# EAGLE design Datalogger Shield RTC (EAGLE 9.5.2)
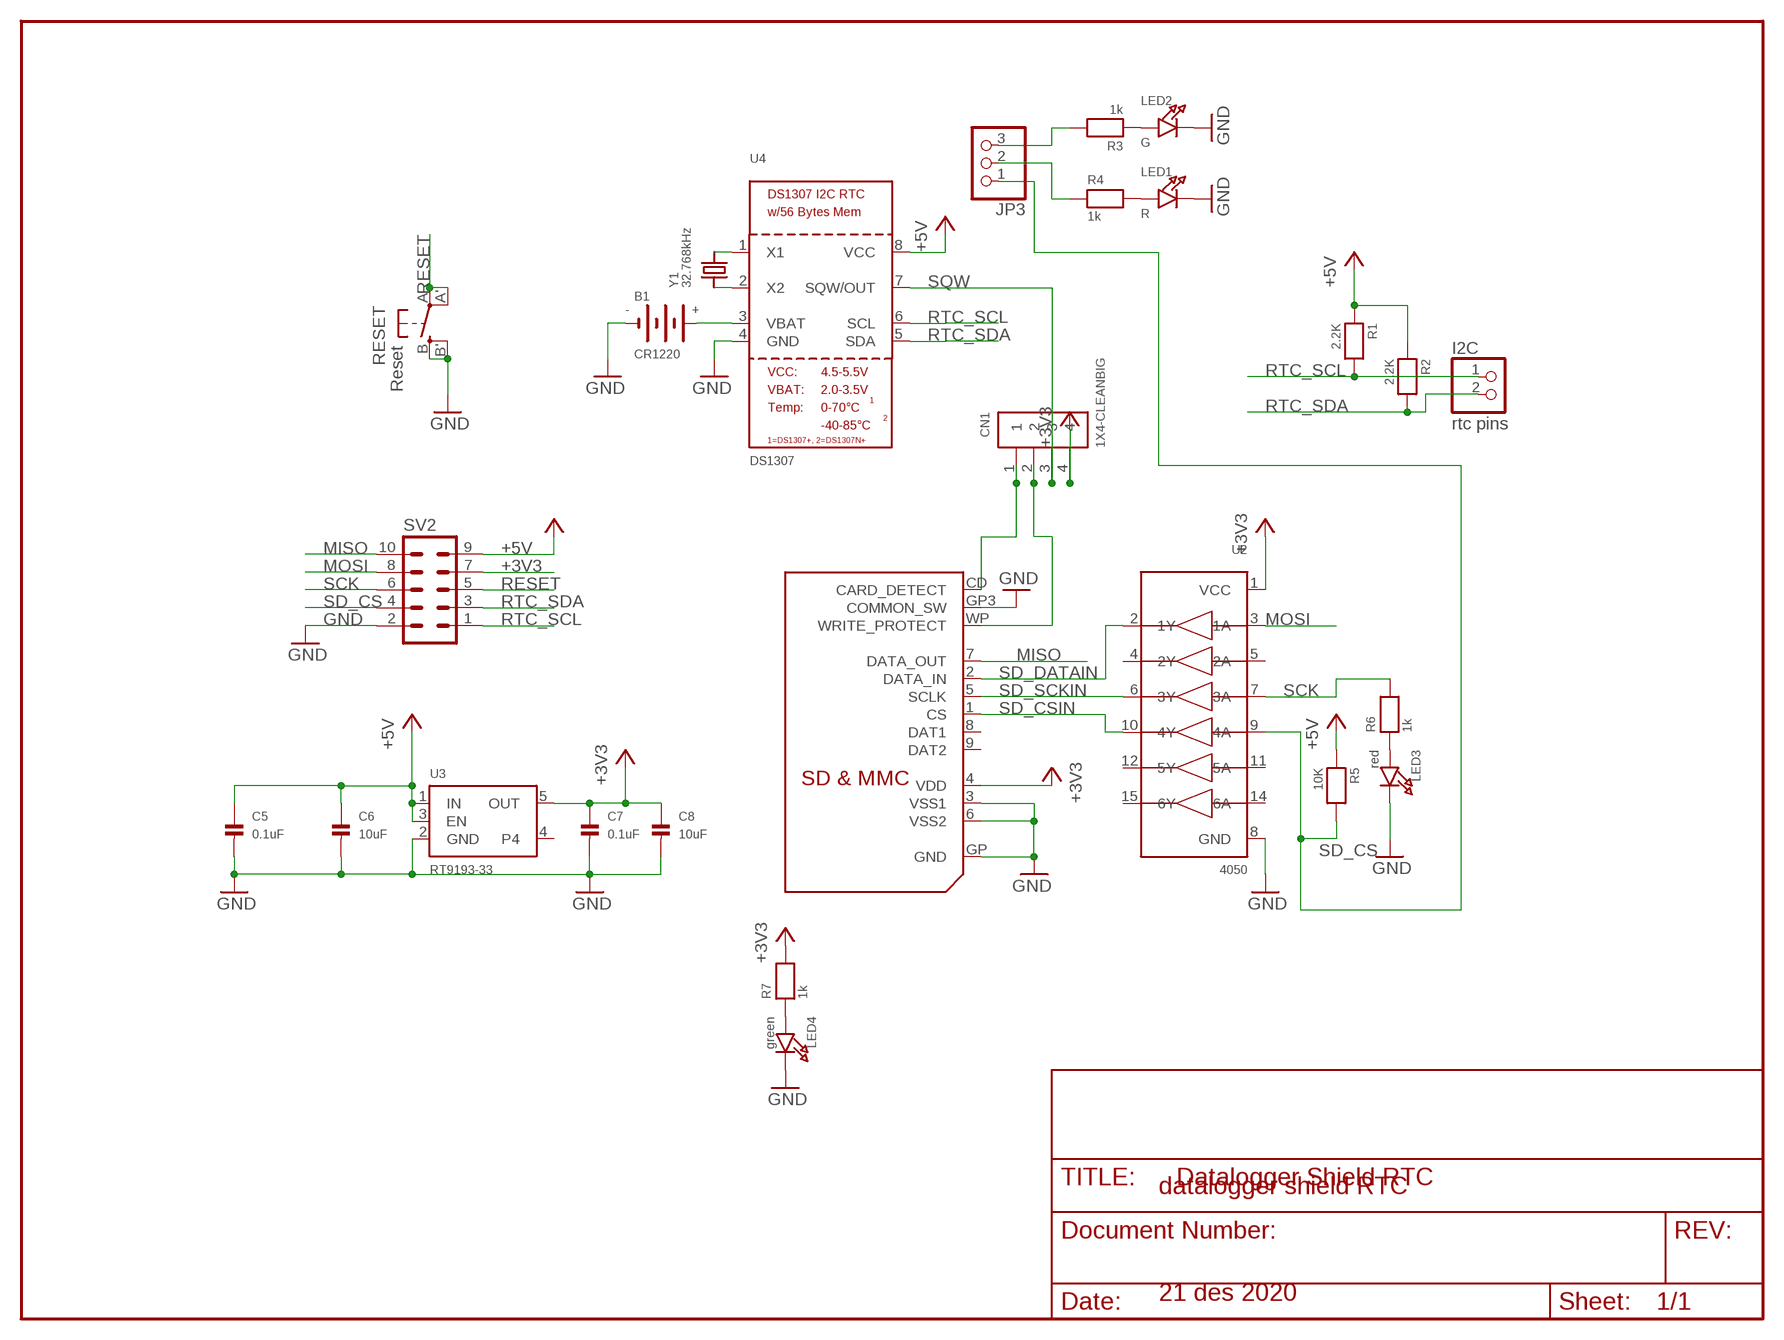
[diagram p0: schematic, sheet 1]

## Parts
B1  CR1220  BATTERYCR1220_SMT  [CR1220]
C5  0.1uF  CAP_CERAMIC0805  [0805]
C6  10uF  CAP_CERAMIC0805  [0805]
C7  0.1uF  CAP_CERAMIC0805  [0805]
C8  10uF  CAP_CERAMIC0805  [0805]
CN1  1X4-CLEANBIG  [1X04-CLEANBIG]
I2C  rtc pins  PINHD-1X2  [1X02]
JP3  HEADER-1X3ROUND  [1X03_ROUND]
LED1  R  LED0805  [CHIPLED_0805]
LED2  G  LED0805  [CHIPLED_0805]
LED3  red  LED0805  [CHIPLED_0805]
LED4  green  LED0805  [CHIPLED_0805]
R1  2.2K  RESISTOR0805  [0805]
R2  2.2K  RESISTOR0805  [0805]
R3  1k  RESISTOR0805  [0805]
R4  1k  RESISTOR0805  [0805]
R5  10K  RESISTOR0805  [0805]
R6  1k  RESISTOR0805  [0805]
R7  1k  RESISTOR0805  [0805]
RESET  Reset  SPST_TACT-EVQQ2  [EVQ-Q2]
SV2  MA05-2  [MA05-2]
U2  4050  74HC4050D  [SOIC16]
U3  RT9193-33  VREG_SOT23-5  [SOT23-5]
U4  DS1307  RTC_DS1307  [SOIC8_150MIL]
U$2  SDMMC06132  [06132]
Y1  32.768kHz  CRYSTAL8X3.8SMT  [CRYSTAL_8X3.8]

## Nets
+3V3: C7.1 C8.1 CN1.4 R7.2 SV2.7 U2.1(VCC) U3.5(OUT) U$2.4(VDD)
+5V: C5.1 C6.1 R1.1 R2.1 R5.1 SV2.9 U3.1(IN) U3.3(EN) U4.8(VCC)
GND: B1.- C5.2 C6.2 C7.2 C8.2 LED1.C LED2.C LED3.C LED4.C RESET.B'(S1) RESET.B(S) SV2.2 U2.8(GND) U3.2(GND) U4.4(GND) U$2.3(VSS1) U$2.6(VSS2) U$2.GP3(COMMON_SW) U$2.GP(GND)
MISO: SV2.10 U$2.7(DATA_OUT)
MOSI: SV2.8 U2.3(1A)
N$1: LED1.A R4.2
N$2: U4.2(X2) Y1.P$1
N$3: U4.1(X1) Y1.P$4
N$4: LED2.A R3.1
N$5: LED3.A R6.1
N$14: B1.+$1(+) U4.3(VBAT)
N$17: JP3.3 R3.2
N$20: JP3.2 R4.1
N$150: LED4.A R7.1
RESET: RESET.A'(P1) RESET.A(P) SV2.5
RTC_SCL: I2C.1 R1.2 SV2.1 U4.6(SCL)
RTC_SDA: I2C.2 R2.2 SV2.3 U4.5(SDA)
SCK: R6.2 SV2.6 U2.7(3A)
SD_CD: CN1.1 U$2.CD(CARD_DETECT)
SD_CS: JP3.1 R5.2 SV2.4 U2.9(4A)
SD_CSIN: U2.10(4Y) U$2.1(CS)
SD_DATAIN: U2.2(1Y) U$2.2(DATA_IN)
SD_SCKIN: U2.6(3Y) U$2.5(SCLK)
SD_WP: CN1.2 U$2.WP(WRITE_PROTECT)
SQW: CN1.3 U4.7(SQW/OUT)
Unconnected: U2.4(2Y) U2.5(2A) U2.11(5A) U2.12(5Y) U2.14(6A) U2.15(6Y) U3.4 U$2.8(DAT1) U$2.9(DAT2)

## Notes on the sheet
- datalogger shield RTC
- 21 des 2020

## Library data of the parts
B1 = microbuilder:BATTERY
C5-C8 = microbuilder:CAP_CERAMIC: Ceramic Capacitors 0402 - 0402 Surface Mount Capacitors 16pF 50V 5% [Digikey: 445-4899-2-ND] 18pF 50V 5% [Digikey: 490-1281-2-ND] 22pF 50V 5% [Digikey: 490-1283-2-ND] 68pF 50V 5% [Digikey: 490-1289-2-ND] 0.1uF 10V 10% [Digikey: 490-1318-2-ND] 1.0uF 6.3V 10% [Digikey: 490-1320-2-ND] 0603 - 0603 Surface Mount Capacitors 16 pF 50V 5% [Digikey: 445-5051-2-ND] 22 pF 50V [Digikey: PCC220ACVTR-ND] 33 pF 50V 5% [Digikey: 490-1415-1-ND] 56pF 50V 5% [Digikey: 490-1421-1-ND] 220pF 50V 5% [Digikey: 445-1285-1-ND] 680 pF 50V 2200 pF 50V 5% C0G [Digikey: 445-1297-1-ND] 5600 pF 100V 5% X7R [Digikey: 478-3711-1-ND] 0.1 µF 25V 10% [Digikey: PCC2277TR-ND] 0.22 µF 16V 10% X7R [Digikey: 445-1318-1-ND] 1.0 µF 25V 10% [Digikey: 445-5146-2-ND] 0603 - RF Specific 3pF 250V +/-0.1pF RF [Digikey: 712-1347-1-ND] 18 pF 250V 5% [Digikey: 478-3505-1-ND or 712-1322-1-ND] 56 pF 250V 5% C0G RF [Digikey: 490-4867-1-ND] 68 pF 250V RF [Digikey: 490-4868-1-ND] 0805 - 0805 Surface Mount Capacitors 220 pF 250V 2% RF Ceramic Capacitor [Digikey: 712-1398-1-ND] 1000 pF 50V 2% NP0 Ceramic Capacitor [Digikey: 478-3760-1-ND] 0.1 µF 25V 10% Ceramic Capacitor [Digikey: PCC1828TR-ND] 1.0 µF 16V 10% Ceramic Capacitor[Digikey: 490-1691-2-ND] 10.0 µF 10V 10% Ceramic Capacitor[Digikey: 709-1228-1-ND] 10.0 uF 16V 10% Ceramic Capacitor [Digikey: 478-5165-2-ND] 47 uF 6.3V 20% Ceramic Capacitor [Digikey: 587-1779-1-ND or 399-5506-1-ND] 1206 - 1206 Surface Mount Capacitors 47uF 10V 20% Ceramic Capacitor [Digikey: 490-5528-1-ND or 399-5508-1-ND or 445-6010-1-ND] 100uF 6.3V -20%, +80% Y5V Ceramic Capacitor (Digikey: 490-4512-1-ND, Mouser: 81-GRM31CF50J107ZE1L)
CN1 = adafruit:1X4: 4-pin connector
I2C = pinhead:PINHD-1X2: PIN HEADER
JP3 = microbuilder:HEADER-1X3: PIN HEADER
LED1-LED4 = microbuilder:LED: LED 0603 - 0603 Surface Mount Package 2mA: Green LED - Low Power (3.9mcd, 2ma, 1.7Vf) - Digikey: 475-2709-2-ND Orange LED - Low Power (9.8mcd, 2ma, 1.8Vf) - Digikey: 475-1194-2-ND Red LED - Low Power (5mcd, 2ma, 1.8Vf) - Digikey: 475-1195-2-ND Yellow LED - Low Power (7mcd, 2ma, 1.8Vf) - Digikey: 475-1196-2-ND 5mA: Blue LED - Low Power (17mcd, 5ma, 2.9Vf) - Digikey: LNJ937W8CRACT-ND 0805 - 0805 Surface Mount Package 2mA: Red LED (8.8mcd, 2mA, 1.8Vf, Clear) - Low Power [Digikey: 475-2510-1-ND] Green LED (5mcd, 2mA, 1.8Vf, Clear) - Low Power [Digikey: 475-2730-1-ND] Yellow LED (11.3mcd, 2mA, 1.8Vf, Clear) - Low Power [Digikey: 475-2555-1-ND] 20mA: Red LED (104mcd, 20mA, Diffused) - LS R976 [Digikey: 475-1278-6-ND] Red LED (12mcd, 20mA, 2.0Vf, Clear) - APT2012EC [Digikey: 754-1128-1-ND] Green LED (15mcd, 20mA, 2.2Vf, Clear) - APT2012GC [Digikey: 754-1131-1-ND] Orange LED (160mcd, 20mA, 2.1Vf, Clear) - APT2012SECK [Digikey: 754-1130-1-ND] 1206 - 1206 Surface Mount Package Green LED (26mcd, 20mA, Diffused) - LG N971 [Digikey: 475-1407-6-ND] Red LED (15mcd, 20mA, Diffused) - LH N974 [Digikey: 475-1416-6-ND]
R1-R7 = microbuilder:RESISTOR: Resistors 0402 - 0402 Surface Mount Package 22 Ohm 1% 1/16W [Digikey: 311-22.0LRTR-ND] 33 Ohm 5% 1/16W 1.0K 5% 1/16W 1.5K 5% 1/16W 2.0K 1% 1/16W 10.0K 1% 1/16W [Digikey: 311-10.0KLRTR-ND] 10.0K 5% 1/16W [Digikey: RMCF0402JT10K0TR-ND] 12.1K 1% 1/16W [Digikey: 311-22.0LRTR-ND] 100.0K 5% 1/16W 0603 - 0603 Surface Mount Package 0 Ohm 1/10 Watt 1% Resistor 15 Ohm 1/10 Watt 1% Resistor 33 Ohm 1/10 Watt 1% Resistor 49.9 Ohm 1/10 Watt 1% Resistor 100 Ohm 1/10 Watt 1% Resistor 150 Ohm 1/10 Watt 1% Resistor 240 Ohm 1/10 Watt 1% Resistor 390 Ohm 1/10 Watt 1% Resistor 560 Ohm 1/10 Watt 1% Resistor 680 Ohm 1/10 Watt 1% Resistor 750 Ohm 1/10 Watt 1% Resistor 1.0K Ohm 1/10 Watt 1% Resistor 1.5K Ohm 1/10 Watt 1% Resistor 2.0K Ohm 1/10 Watt 1% Resistor 2.2K Ohm 1/10 Watt 1% Resistor 3.3K Ohm 1/10 Watt 1% Resistor 4.7K Ohm 1/10 Watt 1% Resistor 10.0K Ohm 1/10 Watt 1% Resistor 12.0K Ohm 1/10 Watt 1% Resistor 12.1K Ohm 1/10 Watt 1% Resistor 20.0K Ohm 1/10 Watt 1% Resistor 33.0K Ohm 1/10 Watt 1% Resistor 100.0K Ohm 1/10 Watt 1% Resistor 0805 - 0805 Surface Mount Package 0 Ohm 1/8 Watt 1% Resistor 33 Ohm 1/8 Watt 1% Resistor 100 Ohm 1/8 Watt 1% Resistor 150 Ohm 1/8 Watt 1% Resistor 200 Ohm 1/8 Watt 1% Resistor 240 Ohm 1/8 Watt 1% Resistor 330 Ohm 1/8 Watt 1% Resistor 390 Ohm 1/8 Watt 1% Resistor 470 Ohm 1/8 Watt 1% Resistor 1.0K Ohm 1/8 Watt 1% Resistor 1.5K Ohm 1/8 Watt 1% Resistor 2.0K Ohm 1/8 Watt 1% Resistor 4.7K Ohm 1/8 Watt 1% Resistor 5.1K Ohm 1/8 Watt 1% Resistor 5.6K Ohm 1/8 Watt 1% Resistor 10.0K Ohm 1/8 Watt 1% Resistor 22.0K Ohm 1/8 Watt 1% Resistor 33.0K Ohm 1/8 Watt 1% Resistor 100K Ohm 1/8 Watt 1% Resistor 1206 - 1206 Surface Mount Package 2012 - 2010 Surface Mount Package 0.11 Ohm 1/2 Watt 1% Resistor - Digikey: RHM.11UCT-ND
RESET = adafruit:SPST_TACT: SMT 6mm switch, EVQQ2 series http://www.ladyada.net/library/eagle
SV2 = con-lstb:MA05-2: PIN HEADER; OC_FARNELL: unknown; OC_NEWARK: unknown
U2 = microbuilder:74HC4050D: 6-channel level shifter 74HC4050D - 2V-6V Supply Digikey: 74HC4050D,653-ND Mouser: 771-74HC4050D-T
U3 = microbuilder:VREG_SOT23-5: SOT23-5 Fixed Voltage Regulators To better organise some of the SOT23-5 fixed voltage regulators in this library, this new part was created. Part Current Out V Out V In V Dropout Digikey Part No. ADP121 150mA 3.3V 3.4-5.5V 0.09V @ 150mA ADP121-AUJZ33R7CT-ND ADP121 150mA 3.0V 3.1-5.5V 0.09V @ 150mA ADP121-AUJZ30R7CT-ND ADP122 300mA 3.3V 3.4-5.5V 0.085V @ 300mA ADP122AUJZ-3.3-R7CT-ND ADP1712 300mA 3.3V 3.5-5.5V 0.17V @ 300mA ADP1712AUJZ-3.3-R7TR-ND AP7311 (Low Cost) 150mA 3.3V 3.5-6V 0.15V @ 150mA AP7311-33WG-7DICT-ND LD39015M18R 150mA 1.8V 1.9V-5.5V 0.08V @ 100mA 497-6977-1-ND MCP1824T-3302E/OT 300mA 3.3V 3.5V-6V 0.2V @ 300mA MCP1824T-3302E/OTCT-ND MIC5205-2.5YM5 TR 150mA 2.5V 2.7-16V 0.165V @ 150mA 576-1257-2-ND MIC5205-3.0YM5 TR 150mA 3.0V 3.2V-16V 0.165V @ 150mA 576-1258-2-ND MIC5205-3.3YM5 TR 150mA 3.3V 3.5V-16V 0.165V @ 150mA 576-1259-2-ND TPS780330220 150mA 3.3V+2.2V 3.6-5.5V 250mV Max 296-23332-1-ND TDA3663/N1,135 100mA 3.3V 3.5-45V 0.18V @ 50mA 568-5343-1-ND
U4 = microbuilder:RTC_DS1307: DS1307 I2C RTC with 56-Bytes RAM; SPICEPREFIX: X
U$2 = adafruit:SDMMC: SD MMC Card holder 4UCON part #06132 - easy to solder
Y1 = microbuilder:CRYSTAL: Crystals HC49UP - Surface Mount Crystal 4.0MHz 18pF +/-30ppm Surface Mount Crystal [Digikey: 535-9857-1-ND] 12.0 MHz Surface Mount Crystal [Digikey: 535-9869-6-ND] 25.0 MHz Surface Mount Crystal [Digikey: 535-9078-1-ND] 3.2 x 2.5mm - MEMs SMT Crystal 12.0 MHz 8pF 15ppm 3.2 x 2.5mm Crystal [Digikey: -10-70°C: 644-1047-1-ND -40-125°C: 644-1128-1-ND] 16.0 MHz 8pF 15ppm 3.2 x 2.5mm Crystal [Digikey: -10-70°C: 644-1049-1-ND -40-125°C: 644-1129-2-ND] 16.0 MHz 10pF 10ppm 3.2 x 2.5mm Crystal [Digikey: 644-1100-1-ND] 27.12 MHz 18pF 30ppm 3.2 x 2.5mm Crystal [Digikey: 887-1424-1-ND] 27.12MHz 10pF 10ppm 3.2 x 2.5mm Crystal [Digikey: 887-1329-1-ND] 4.9 x 1.8mm - MEMs SMT Crystal 32.768 KHz 12.5pF 20ppm 4.9 x 1.8mm Crystal [Digikey: SE2415CT-ND] 8.0 x 3.8mm - Surface Mount Crystal 32.768kHz 12.5pF 20ppm -40°C-85°C [Digikey: 535-9166-2-ND] Cylinder 32.768KHz Cylinder Crystal (2x6mm body) [Ex. Digikey: 300-8341-2-ND]

## Board
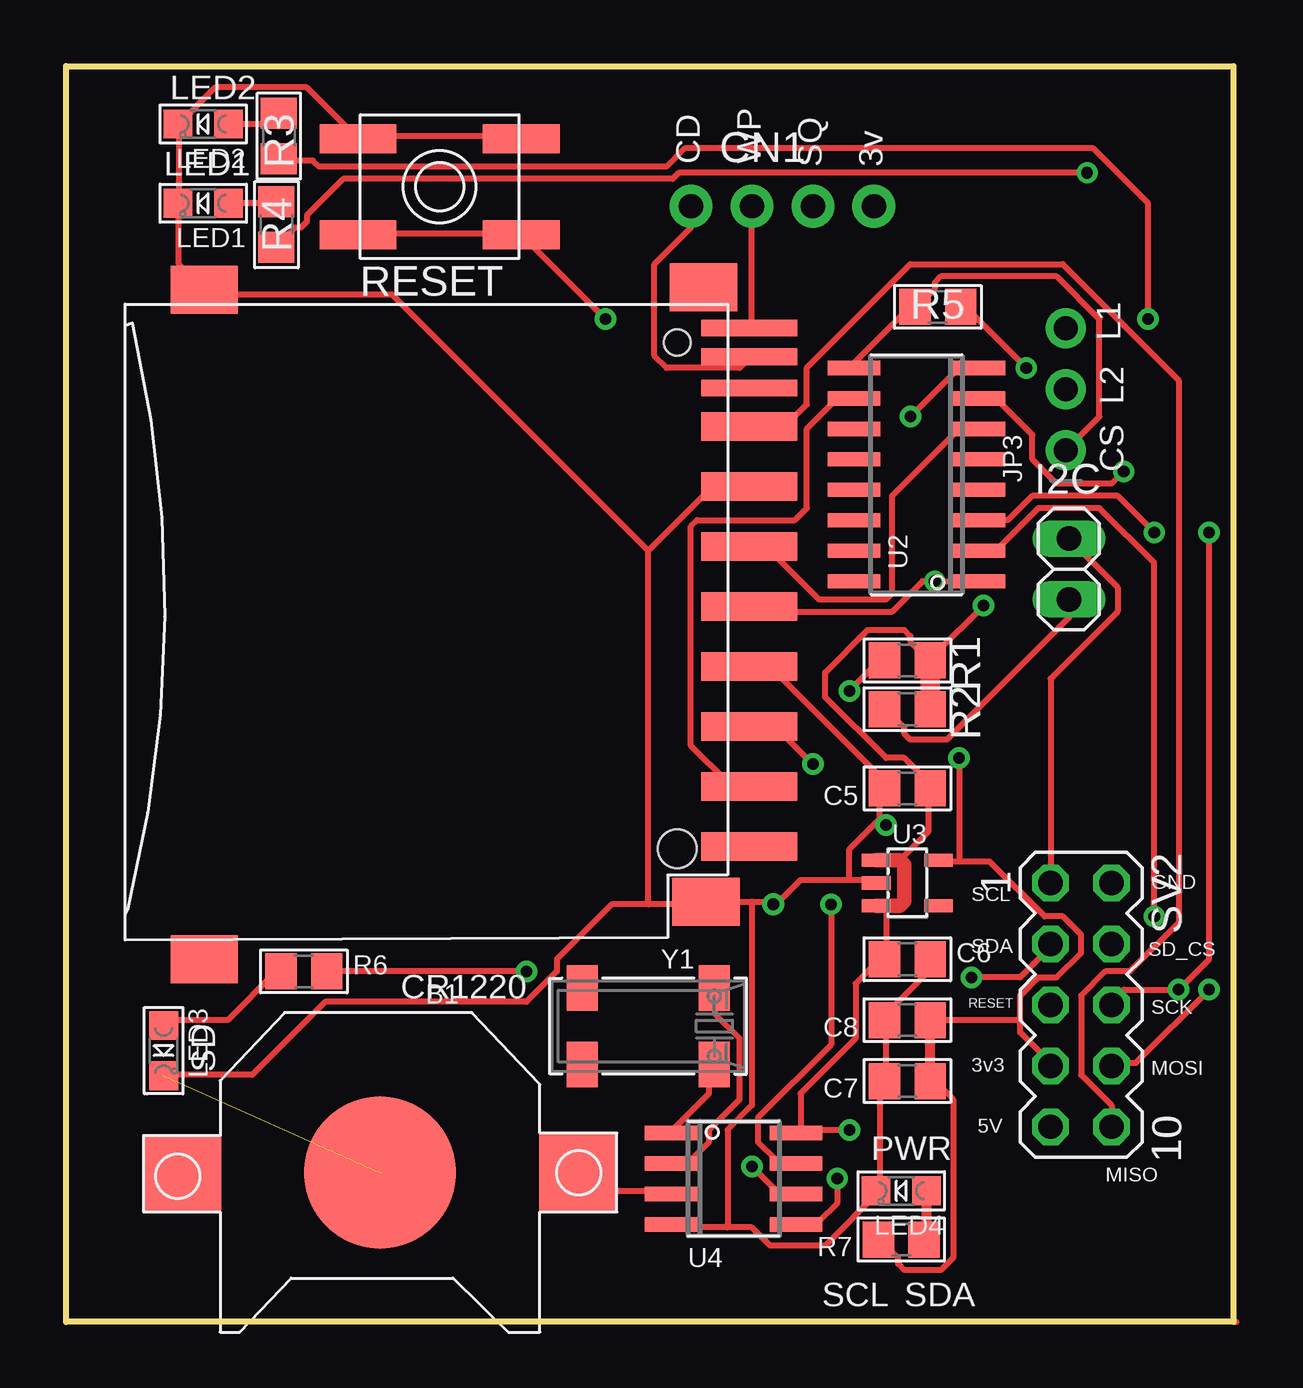
[diagram p1: board, top side]
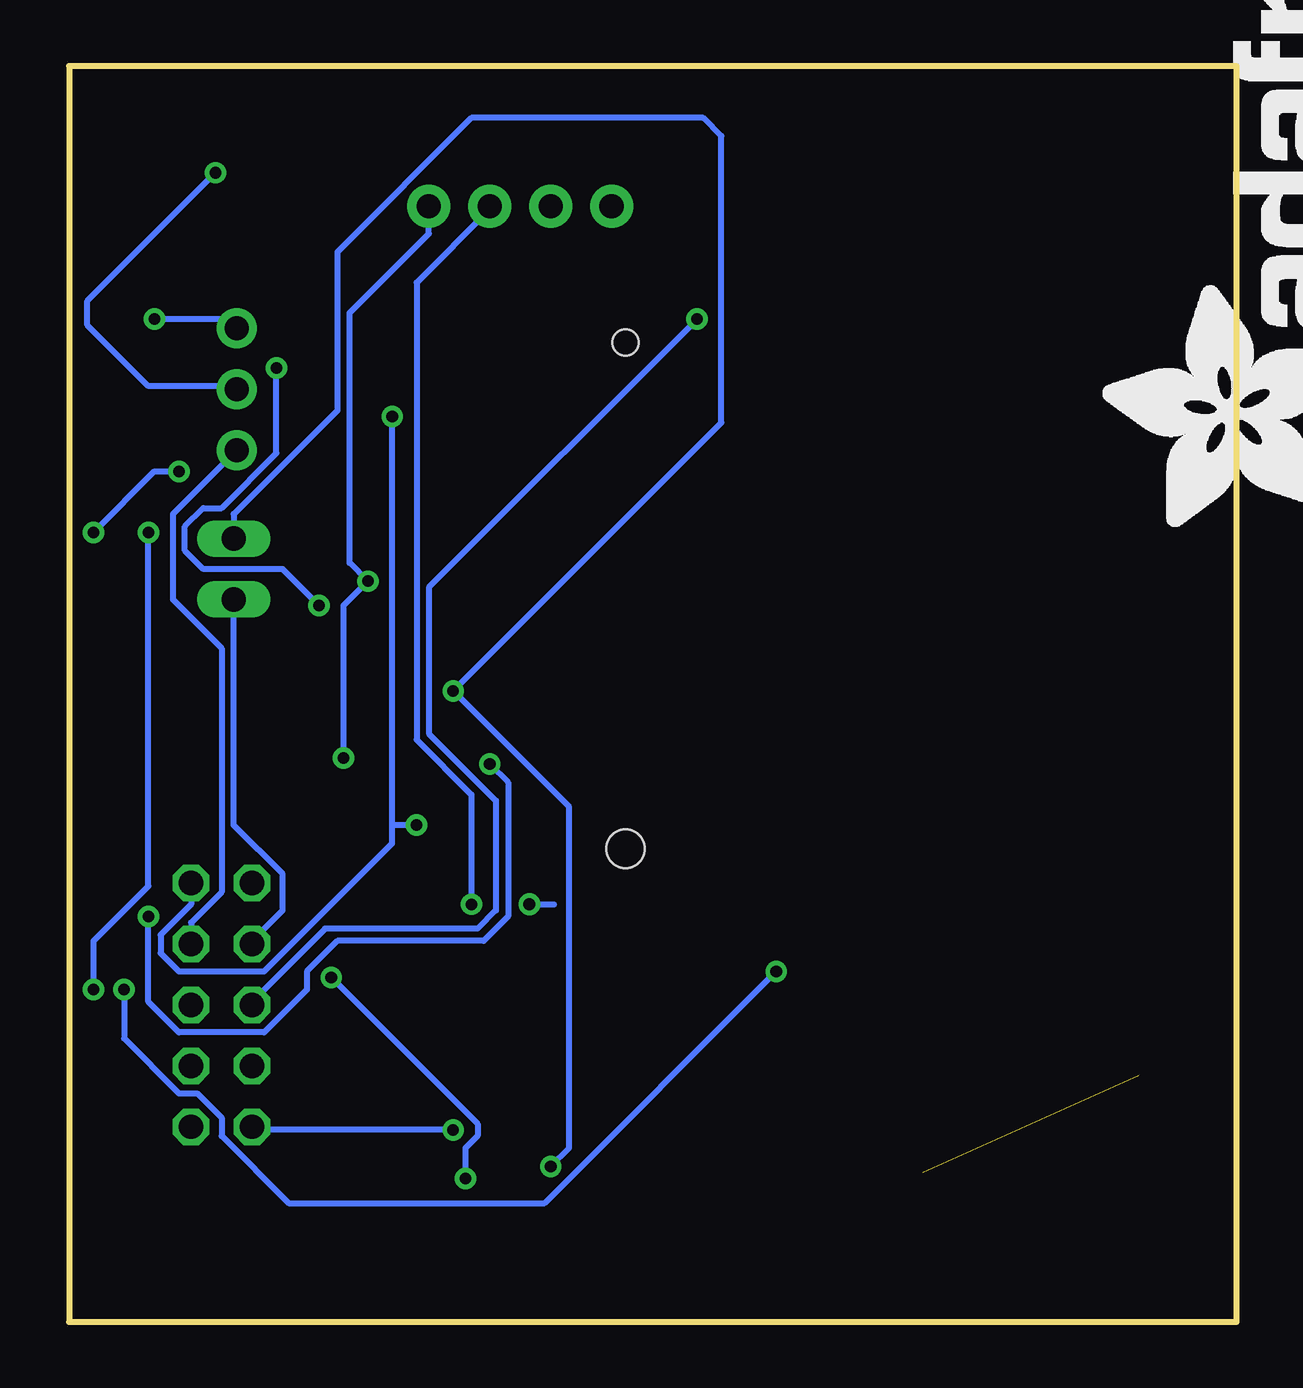
[diagram p2: board, bottom side, seen from below]

Size 48.64 x 52.32 mm. Coordinates in mm from the lower left corner, seen from the top.
Outline: 0,52.32 48.64,52.32 48.64,0 0,0 0,52.32
Copper layers (1*16): Top 0.035mm / dielectric 1.5mm / Bottom 0.035mm
Design rules "default": minimum track width 10mil, minimum drill 19mil, track to track 10mil, track to pad 10mil, pad to pad 10mil, via to via 10mil, smd to smd 8mil, copper to edge 10mil, drill to drill 8mil, minimum pad ring 10mil, minimum via ring 8mil, stop-mask expansion 4mil, vias tented up to drill 20mil, thermal gap 10mil

### Footprints (pad centres in the part's own frame; a part is rotated, then mirrored left to right if it is on the bottom)
CR1220 = smd 3.2 x 3.2: +$1 -8.225,0; +$2 8.225,0 | smd 6.35 x 6.35: - 0,0
0805 = smd 1.3 x 1.5: 1 -0.95,0; 2 0.95,0
1X04-CLEANBIG = drill 1.016 pad 1.778: 1 -3.81,0; 2 -1.27,0; 3 1.27,0; 4 3.81,0
1X02 = drill 1.016 long: 1 -1.27,0; 2 1.27,0
1X03_ROUND = drill 1 pad 1.676: 1 -2.54,0; 2 0,0; 3 2.54,0
CHIPLED_0805 = smd 1.2 x 1.2: A 0,-1.05; C 0,1.05
EVQ-Q2 = smd 3.2 x 1.2: A -3.4,-2; A' 3.4,-2; B -3.4,2; B' 3.4,2
MA05-2 = drill 1.016 octagon: 1 -5.08,-1.27; 2 -5.08,1.27; 3 -2.54,-1.27; 4 -2.54,1.27; 5 0,-1.27; 6 0,1.27; 7 2.54,-1.27; 8 2.54,1.27; 9 5.08,-1.27; 10 5.08,1.27
SOIC16 = smd 0.6 x 2.2: 1 -4.445,-2.6; 2 -3.175,-2.6; 3 -1.905,-2.6; 4 -0.635,-2.6; 5 0.635,-2.6; 6 1.905,-2.6; 7 3.175,-2.6; 8 4.445,-2.6; 9 4.445,2.6; 10 3.175,2.6; 11 1.905,2.6; 12 0.635,2.6; 13 -0.635,2.6; 14 -1.905,2.6; 15 -3.175,2.6; 16 -4.445,2.6
SOT23-5 = smd 0.55 x 1.2: 1 -0.95,-1.3; 2 0,-1.3; 3 0.95,-1.3; 4 0.95,1.3; 5 -0.95,1.3
SOIC8_150MIL = smd 0.6 x 2.2: 1 -1.905,-2.6; 2 -0.635,-2.6; 3 0.635,-2.6; 4 1.905,-2.6; 5 1.905,2.6; 6 0.635,2.6; 7 -0.635,2.6; 8 -1.905,2.6
06132 = smd 1.2 x 4: 1 6.9,0.9; 2 4.4,0.9; 3 1.9,0.9; 4 -0.6,0.9; 5 -3.1,0.9; 6 -5.6,0.9; 7 -8.1,0.9; 9 9.4,0.9 | smd 0.7 x 4: 8 -9.7,0.9; CD -11,0.9; WP -12.2,0.9 | smd 2 x 2.8: GP -13.8,-21.8; GP2 14.1,-21.8; GP3 11.7,-0.9; GP4 -13.9,-1 | hole 1.1: -11.6,-2.1 | hole 1.6: 9.5,-2.1
CRYSTAL_8X3.8 = smd 1.3 x 1.9: P$1 -2.75,-1.6; P$2 2.75,-1.6; P$3 2.75,1.6; P$4 -2.75,1.6

### Placement (x,y rotation side)
B1  13.08,6.22 180 top
C5  35.05,22.23 180 top
C6  35.05,15.11 0 top
C7  35.05,10.03 180 top
C8  35.05,12.57 180 top
CN1  29.84,46.48 0 top
I2C  41.78,31.37 270 top
JP3  41.66,38.86 90 top
LED1  5.72,46.61 90 top
LED2  5.72,49.91 90 top
LED3  4.06,11.3 180 top
LED4  34.8,5.46 90 top
R1  35.05,27.56 180 top
R2  35.05,25.53 180 top
R3  8.87,49.41 270 top
R4  8.76,45.72 90 top
R5  36.32,42.29 180 top
R6  9.91,14.61 0 top
R7  34.8,3.43 180 top
RESET  15.56,47.3 0 top
SV2  42.29,13.21 270 top
U2  35.43,35.31 90 top
U3  35.05,18.29 270 top
U4  27.81,5.97 270 top
U$1  [ADAFRUIT_TEXT_30MM]  -5.97,32.89 90 bottom  (outside the outline)
U$2  27.56,29.21 270 top
Y1  24.26,12.32 180 top

### Tracks (layer width: path | path; a pad name or v marks a point on that pad's centre or on a via)
+3V3  (via drill 0.48)
  Top 0.254: R7.2 33.91,3.43 34.67,2.67 34.67,2.41 34.93,2.16 36.45,2.16 36.96,2.67 36.96,9.27 36.2,10.03 C7.1 | 37.21,19.18 38.48,19.18 40.77,16.89 41.53,16.89 42.29,16.13 42.29,15.37 41.27,14.35 40.51,14.35 39.75,13.59 39.75,12.57 | 37.21,19.18 36.45,19.18 U3.5 | 39.75,12.57 39.75,12.07 41.02,10.8 SV2.7 | 39.75,12.57 C8.1 | U2.1 v36.2,30.86 35.69,30.86 34.42,29.59 28.58,29.59 U$2.4 | v37.21,23.5 37.21,19.18
  Top 0.406: C7.1 C8.1
  Bottom 0.254: CN1.4 33.66,45.34 36.96,42.04 36.96,31.62 v36.2,30.86 37.21,29.84 v37.21,23.5
+5V  (via drill 0.48)
  Top 0.254: v40.01,39.75 37.47,42.29 R5.1 | v38.23,29.84 36.2,27.81 R1.1 35.69,27.81 35.18,28.32 35.18,28.58 34.93,28.83 33.4,28.83 31.62,27.05 31.62,26.04 34.16,23.5 34.93,23.5 36.2,22.23 C5.1 35.94,22.23 35.94,20.45 34.93,19.43 34.74,19.24 | U3.3 34.16,17.14 34.16,15.11 C6.1 33.91,15.11 32.89,14.1 32.89,11.81 30.61,9.53 30.61,8 | 30.61,8 v32.64,8 | 30.61,8 U4.8
  Top 0.61: U3.1 34.74,19.24 34.93,19.05 34.93,17.53 34.74,17.34 U3.3
  Top 0.813: R1.1 R2.1
  Bottom 0.254: v40.01,39.75 40.01,36.2 42.29,33.91 43.05,33.91 43.81,33.15 43.81,32.13 43.05,31.37 39.75,31.37 v38.23,29.84 | v32.64,8 41.02,8 SV2.9
GND  (via drill 0.48, 0.5)  (1 unrouted)
  Top 0.254: 28.58,17.51 U$2.GP3 26.54,17.4 24.26,17.4 | 28.58,17.51 29.35,17.51 v29.46,17.4 29.59,17.4 30.61,18.41 32.64,18.41 | U2.8 37.21,39.75 v35.18,37.72 | 4.7,49.91 4.7,46.61 | 4.7,46.61 4.7,44.07 5.72,43.05 U$2.GP 5.97,42.8 13.59,42.8 24.26,32.13 | 4.7,46.61 LED1.C | RESET.B' 18.92,49.4 12.32,49.4 RESET.B 12.07,49.4 10.03,51.44 6.22,51.44 4.7,49.91 | 4.7,49.91 LED2.C | 33.91,5.46 33.91,10.03 C7.2 34.16,10.03 34.16,12.57 C8.2 33.91,12.57 35.94,14.61 35.94,15.11 C6.2 | 27.56,3.94 28.58,3.94 29.34,3.18 31.62,3.18 33.91,5.46 | 27.56,3.94 25.27,3.94 U4.4 | 33.91,5.46 LED4.C | 24.26,17.4 22.73,17.4 20.45,15.11 20.45,14.61 19.18,13.34 10.8,13.34 7.75,10.29 4.19,10.29 LED3.C | 32.64,18.41 33.66,18.41 U3.2 | 33.91,20.96 33.91,22.23 | 33.91,20.96 32.64,19.69 32.64,18.41 | 33.91,22.23 33.91,22.73 29.34,27.3 28.58,27.3 U$2.3 | 33.91,22.23 C5.2 | 24.26,32.13 26.8,34.67 28.32,34.67 U$2.6 | 24.26,17.4 24.26,32.13 | 27.56,3.94 27.56,8 28.58,9.02 28.58,17.51 | 33.91,20.96 v34.16,20.7
  Top 0.406: 33.8,5.51 LED4.C
  Bottom 0.254: v29.46,17.4 28.45,17.4 | 35.18,20.7 35.18,19.94 40.51,14.61 44.07,14.61 44.83,15.37 44.83,16.13 43.56,17.4 SV2.2 | 35.18,20.7 v35.18,37.72 | v34.16,20.7 35.18,20.7
MISO
  Top 0.254: SV2.10 43.56,9.02 42.29,10.29 42.29,13.59 43.31,14.61 44.32,14.61 46.36,16.64 46.36,39.24 41.53,44.07 35.18,44.07 30.86,39.75 30.86,38.23 30.1,37.47 28.58,37.47 U$2.7
MOSI  (via drill 0.48)
  Top 0.254: U2.3 39.24,33.4 40.26,34.42 43.81,34.42 v45.34,32.89 | v47.62,13.84 44.58,10.8 43.56,10.8 SV2.8
  Bottom 0.254: v45.34,32.89 45.34,18.16 47.62,15.88 v47.62,13.84
N$1
  Top 0.254: LED1.A 8.76,46.61 R4.2
N$2
  Top 0.254: Y1.P$1 27.05,13.84 27.05,12.83 28.07,11.81 28.07,9.27 26.8,8 26.8,7.49 26.04,6.73 25.27,6.73 U4.2
N$3
  Top 0.254: Y1.P$4 26.8,10.54 26.8,9.53 25.27,8 U4.1
N$4
  Top 0.254: LED2.A 8.51,49.91 8.76,50.17 R3.1
N$5
  Top 0.254: LED3.A 4.19,12.57 6.73,12.57 8.76,14.61 R6.1
N$6
  Top 0.254: 48.64,0 48.64,52.32 0,52.32 0,0 48.64,0 | 48.64,0 48.77,0
N$14
  Top 0.254: U4.3 25.02,5.46 22.23,5.46 21.46,6.22 B1.+$1
N$17  (via drill 0.48)
  Top 0.254: v45.09,41.78 45.09,46.61 42.8,48.89 25.78,48.89 25.02,48.13 10.54,48.13 10.29,48.39 9.02,48.39 R3.2
  Bottom 0.254: v45.09,41.78 42.04,41.78 JP3.3
N$20  (via drill 0.48)
  Top 0.254: v42.55,47.88 25.53,47.88 25.27,47.62 11.56,47.62 10.03,46.1 10.03,45.85 9.78,45.59 9.52,45.59 8.76,44.83 R4.1
  Bottom 0.254: v42.55,47.88 47.88,42.55 47.88,41.53 45.34,38.99 41.78,38.99 JP3.2
N$150
  Top 0.406: LED4.A 35.85,3.53 R7.1
RESET  (via drill 0.48)
  Top 0.254: v22.48,41.78 19.18,45.09 RESET.A' 18.92,45.34 12.32,45.34 RESET.A
  Bottom 0.254: v22.48,41.78 33.66,30.61 33.66,24.51 30.86,21.72 30.86,17.14 31.62,16.38 37.97,16.38 41.02,13.34 SV2.5
RTC_SCL  (via drill 0.48)
  Top 0.254: SV2.1 41.02,26.8 43.81,29.59 43.81,30.61 I2C.1 | v32.64,26.29 33.91,27.56 R1.2 | v28.58,6.48 29.59,5.46 30.35,5.46 U4.6
  Bottom 0.254: v28.58,6.48 27.81,7.24 27.81,21.46 v32.64,26.29 21.46,37.47 21.46,49.4 22.23,50.17 31.88,50.17 37.47,44.58 37.47,37.97 41.78,33.66 I2C.1
RTC_SDA  (via drill 0.48)
  Top 0.254: I2C.2 41.78,29.34 36.7,24.26 35.18,24.26 34.93,24.51 34.93,24.77 34.16,25.53 R2.2 | v32.13,5.97 32.13,4.95 31.37,4.19 30.61,4.19 U4.5 | v37.72,14.35 39.75,14.35 41.02,15.62 SV2.3
  Bottom 0.254: v32.13,5.97 32.13,7.24 31.62,7.75 31.62,8.26 v37.72,14.35 | I2C.2 41.78,20.7 39.75,18.67 39.75,17.14 41.02,15.88 SV2.3
SCK  (via drill 0.48)
  Top 0.254: v19.18,14.61 R6.2 | SV2.6 43.56,13.34 44.07,13.84 v46.36,13.84 47.62,15.11 v47.62,32.89 | U2.7 38.73,38.48 40.26,36.96 40.26,35.94 41.27,34.92 43.56,34.92 v44.07,35.43
  Bottom 0.254: v19.18,14.61 28.83,4.95 39.5,4.95 42.29,7.75 42.29,8.51 43.31,9.53 44.07,9.53 46.36,11.81 v46.36,13.84 | v44.07,35.43 45.09,35.43 v47.62,32.89
SD_CD
  Top 0.254: CN1.1 26.04,45.59 24.51,44.07 24.51,40.26 25.02,39.75 28.07,39.75 28.32,40.01 U$2.CD
SD_CS
  Top 0.254: U2.9 32.64,39.75 35.18,42.29 R5.2 35.43,42.29 36.2,43.05 36.2,43.31 36.45,43.56 41.27,43.56 43.05,41.78 43.05,37.72 JP3.1
  Bottom 0.254: SV2.4 43.56,16.64 42.29,17.91 42.29,28.07 44.32,30.1 44.32,33.66 JP3.1
SD_CSIN
  Top 0.254: U2.10 32.13,38.48 30.86,37.21 30.86,33.91 30.35,33.4 26.29,33.4 26.04,33.15 26.04,24 27.56,22.48 28.32,22.48 U$2.1
SD_DATAIN  (via drill 0.48)
  Top 0.254: U2.2 38.73,32.13 40.51,33.91 43.05,33.91 45.34,31.62 v45.34,16.89 | v31.12,23.24 29.59,24.77 28.58,24.77 U$2.2
  Bottom 0.254: v45.34,16.89 45.34,13.34 44.07,12.07 40.51,12.07 38.73,13.84 38.73,14.61 37.47,15.88 31.37,15.88 30.35,16.89 30.35,22.48 v31.12,23.24
SD_SCKIN
  Top 0.254: U2.6 37.21,37.21 34.42,34.42 34.42,30.35 34.16,30.1 31.37,30.1 29.34,32.13 28.58,32.13 U$2.5
SD_WP
  Top 0.254: CN1.2 28.58,41.53 U$2.WP
SQW  (via drill 0.48)
  Top 0.254: v31.88,17.4 31.88,11.56 28.83,8.51 28.83,7.49 29.59,6.73 30.35,6.73 U4.7
  Bottom 0.254: v31.88,17.4 31.88,21.97 34.16,24.26 34.16,43.31 31.12,46.36 CN1.3

### Text on the board
tPlace: LED2 | CD | WP | SQ | 3v | LED1 | L1 | L2 | CS | GND | SCL | SDA | SD_CS | CR1220 | RESET | SCK | SD | 3v3 | MOSI | 5V | PWR | MISO | SCL | SDA